# Altium project Compact Inverter H7 Logic Ver B.PrjPcb (part 1 of 2)
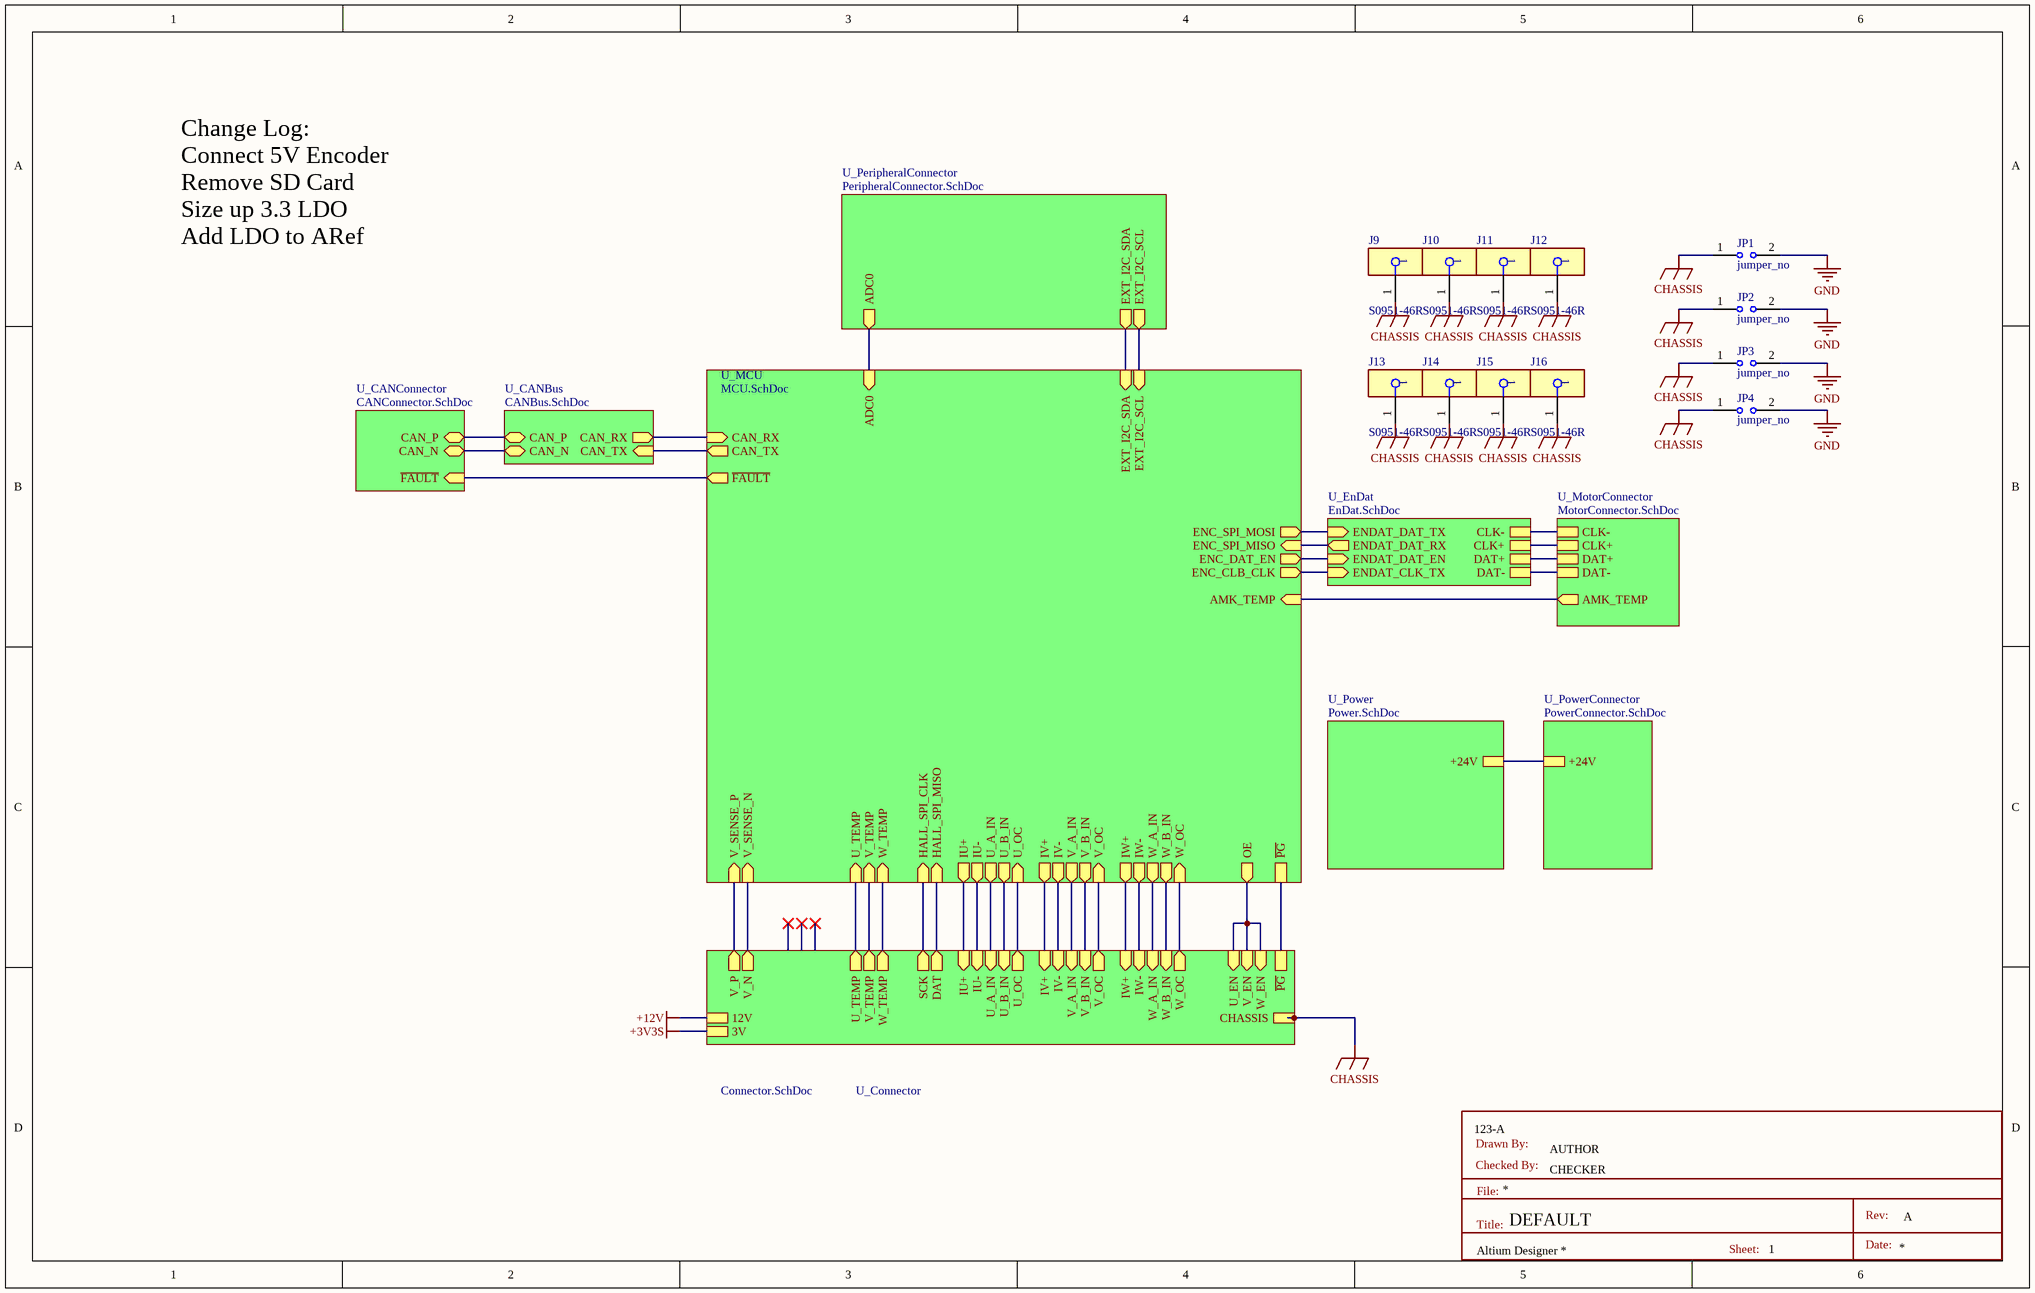
[diagram p0: Top.SchDoc]
11 sheets, 150 parts. Net scope: hierarchical (ports join the sheet entries above them; power ports are global).
Board file: PCB1.PcbDoc
Sheets:
  Top.SchDoc
    U_MCU = MCU.SchDoc
    U_Connector = Connector.SchDoc
    U_EnDat = EnDat.SchDoc
    U_CANBus = CANBus.SchDoc
    U_PeripheralConnector = PeripheralConnector.SchDoc
    U_MotorConnector = MotorConnector.SchDoc
    U_CANConnector = CANConnector.SchDoc
    U_Power = Power.SchDoc
    U_PowerConnector = PowerConnector.SchDoc
  SDMMC.SchDoc

## Sheet Top.SchDoc: DEFAULT
size B; CheckedBy: CHECKER; Author: AUTHOR; Revision: A; SheetNumber: 1; SheetTotal: 11; PartNumber: 123

### Parts
J9  S0951-46R  [FP-S0951-46R-MFG]
J10  S0951-46R  [FP-S0951-46R-MFG]
J11  S0951-46R  [FP-S0951-46R-MFG]
J12  S0951-46R  [FP-S0951-46R-MFG]
J13  S0951-46R  [FP-S0951-46R-MFG]
J14  S0951-46R  [FP-S0951-46R-MFG]
J15  S0951-46R  [FP-S0951-46R-MFG]
J16  S0951-46R  [FP-S0951-46R-MFG]
JP1  jumper_no  [jumper_no]
JP2  jumper_no  [jumper_no]
JP3  jumper_no  [jumper_no]
JP4  jumper_no  [jumper_no]

### Sub-sheets
U_CANBus = CANBus.SchDoc: CAN_TX (in), CAN_RX (out), CAN_P (bidir), CAN_N (bidir)
U_CANConnector = CANConnector.SchDoc: CAN_P (bidir), CAN_N (bidir), ~{FAULT} (in)
U_Connector = Connector.SchDoc: U_B_IN (in), U_A_IN (in), U_EN (in), U_OC (out), V_A_IN (in), V_B_IN (in), V_EN (in), V_OC (out), W_EN (in), W_OC (out), W_A_IN (in), W_B_IN (in), V_N (out), V_P (out), W_TEMP (out), V_TEMP (out), U_TEMP (out), 3V, 12V, CHASSIS, SCK (out), DAT (out), ~{PG}, IU+ (in), IU- (in), IV+ (in), IV- (in), IW+ (in), IW- (in)
U_EnDat = EnDat.SchDoc: CLK-, CLK+, DAT+, DAT-, ENDAT_DAT_RX (out), ENDAT_DAT_EN (in), ENDAT_DAT_TX (in), ENDAT_CLK_TX (in)
U_MCU = MCU.SchDoc: ENC_SPI_MOSI (out), ENC_SPI_MISO (in), HALL_SPI_MISO (in), HALL_SPI_CLK (in), EXT_I2C_SCL (in), EXT_I2C_SDA (in), CAN_RX (in), CAN_TX (out), V_A_IN (out), V_B_IN (out), V_OC (in), V_TEMP (in), U_A_IN (out), U_B_IN (out), U_OC (in), U_TEMP (in), W_A_IN (out), W_B_IN (out), W_OC (in), W_TEMP (in), AMK_TEMP (in), ENC_DAT_EN (out), ENC_CLB_CLK (out), V_SENSE_P (in), V_SENSE_N (in), OE (out), ~{FAULT} (out), ADC0 (in), ~{PG}, IU- (out), IW- (out), IU+ (out), IV+ (out), IW+ (out), IV- (out)
U_MotorConnector = MotorConnector.SchDoc: AMK_TEMP (out), CLK-, CLK+, DAT+, DAT-
U_PeripheralConnector = PeripheralConnector.SchDoc: EXT_I2C_SCL (out), EXT_I2C_SDA (out), ADC0 (out)
U_Power = Power.SchDoc: +24V
U_PowerConnector = PowerConnector.SchDoc: +24V

### Nets
CHASSIS: J9.1 J10.1 J11.1 J12.1 J13.1 J14.1 J15.1 J16.1 JP1.1 JP2.1 JP3.1 JP4.1 ; sheet U_Connector/CHASSIS
GND: JP1.2 JP2.2 JP3.2 JP4.2
+24V: sheet U_Power/+24V, sheet U_PowerConnector/+24V
ADC0: sheet U_MCU/ADC0, sheet U_PeripheralConnector/ADC0
CAN_N: sheet U_CANBus/CAN_N, sheet U_CANConnector/CAN_N
CAN_P: sheet U_CANBus/CAN_P, sheet U_CANConnector/CAN_P
DAT: sheet U_MCU/HALL_SPI_MISO, sheet U_Connector/DAT
ENC_CLB_CLK: sheet U_MCU/ENC_CLB_CLK, sheet U_EnDat/ENDAT_CLK_TX
ENC_DAT_EN: sheet U_MCU/ENC_DAT_EN, sheet U_EnDat/ENDAT_DAT_EN
ENC_SPI_MISO: sheet U_MCU/ENC_SPI_MISO, sheet U_EnDat/ENDAT_DAT_RX
ENC_SPI_MOSI: sheet U_MCU/ENC_SPI_MOSI, sheet U_EnDat/ENDAT_DAT_TX
~{FAULT}: sheet U_MCU/~{FAULT}, sheet U_CANConnector/~{FAULT}
FDCAN1_RX: sheet U_MCU/CAN_RX, sheet U_CANBus/CAN_RX
FDCAN1_TX: sheet U_MCU/CAN_TX, sheet U_CANBus/CAN_TX
HALL_SPI_CLK_S: sheet U_MCU/HALL_SPI_CLK, sheet U_Connector/SCK
I2C1_SCK: sheet U_MCU/EXT_I2C_SCL, sheet U_PeripheralConnector/EXT_I2C_SCL
I2C1_SDA: sheet U_MCU/EXT_I2C_SDA, sheet U_PeripheralConnector/EXT_I2C_SDA
IU+: sheet U_MCU/IU+, sheet U_Connector/IU+
IU-: sheet U_MCU/IU-, sheet U_Connector/IU-
IV+: sheet U_MCU/IV+, sheet U_Connector/IV+
IV-: sheet U_MCU/IV-, sheet U_Connector/IV-
IW+: sheet U_MCU/IW+, sheet U_Connector/IW+
IW-: sheet U_MCU/IW-, sheet U_Connector/IW-
OE: sheet U_MCU/OE, sheet U_Connector/U_EN, sheet U_Connector/V_EN, sheet U_Connector/W_EN
~{PG}_S: sheet U_MCU/~{PG}, sheet U_Connector/~{PG}
TEMP1: sheet U_MCU/U_TEMP, sheet U_Connector/U_TEMP
TEMP2: sheet U_MCU/V_TEMP, sheet U_Connector/V_TEMP
TEMP3: sheet U_MCU/W_TEMP, sheet U_Connector/W_TEMP
TEMP4: sheet U_MCU/AMK_TEMP, sheet U_MotorConnector/AMK_TEMP
U_A_IN: sheet U_MCU/U_A_IN, sheet U_Connector/U_A_IN
U_B_IN: sheet U_MCU/U_B_IN, sheet U_Connector/U_B_IN
U_OC: sheet U_MCU/U_OC, sheet U_Connector/U_OC
V_A_IN: sheet U_MCU/V_A_IN, sheet U_Connector/V_A_IN
V_B_IN: sheet U_MCU/V_B_IN, sheet U_Connector/V_B_IN
V_OC: sheet U_MCU/V_OC, sheet U_Connector/V_OC
V_SENSE_N: sheet U_MCU/V_SENSE_N, sheet U_Connector/V_N
V_SENSE_P: sheet U_MCU/V_SENSE_P, sheet U_Connector/V_P
W_A_IN: sheet U_MCU/W_A_IN, sheet U_Connector/W_A_IN
W_B_IN: sheet U_MCU/W_B_IN, sheet U_Connector/W_B_IN
W_OC: sheet U_MCU/W_OC, sheet U_Connector/W_OC
NetC1_2: sheet U_EnDat/DAT+, sheet U_MotorConnector/DAT+
NetC3_1: sheet U_EnDat/DAT-, sheet U_MotorConnector/DAT-
NetC4_2: sheet U_EnDat/CLK+, sheet U_MotorConnector/CLK+
NetC6_1: sheet U_EnDat/CLK-, sheet U_MotorConnector/CLK-

### Notes on the sheet
- Change Log:
  Connect 5V Encoder
  Remove SD Card
  Size up 3.3 LDO
  Add LDO to ARef
- Drawn By:
- Checked By:
- File:
- Title:
- Sheet:
- Rev:
- Date:

### Library data of the parts
J9-J16 = CMP-15817-000012-1: RFI SHIELD CLIP MINI TIN SMD; Width: 0.04inch; Min Operating Temperature: -40°C; Max Operating Temperature: 185°C; Thickness: 0.051inch; REACH SVHC: No SVHC; Length: 0.155inch

## Sheet MCU.SchDoc
size B; SheetNumber: 5; SheetTotal: 11
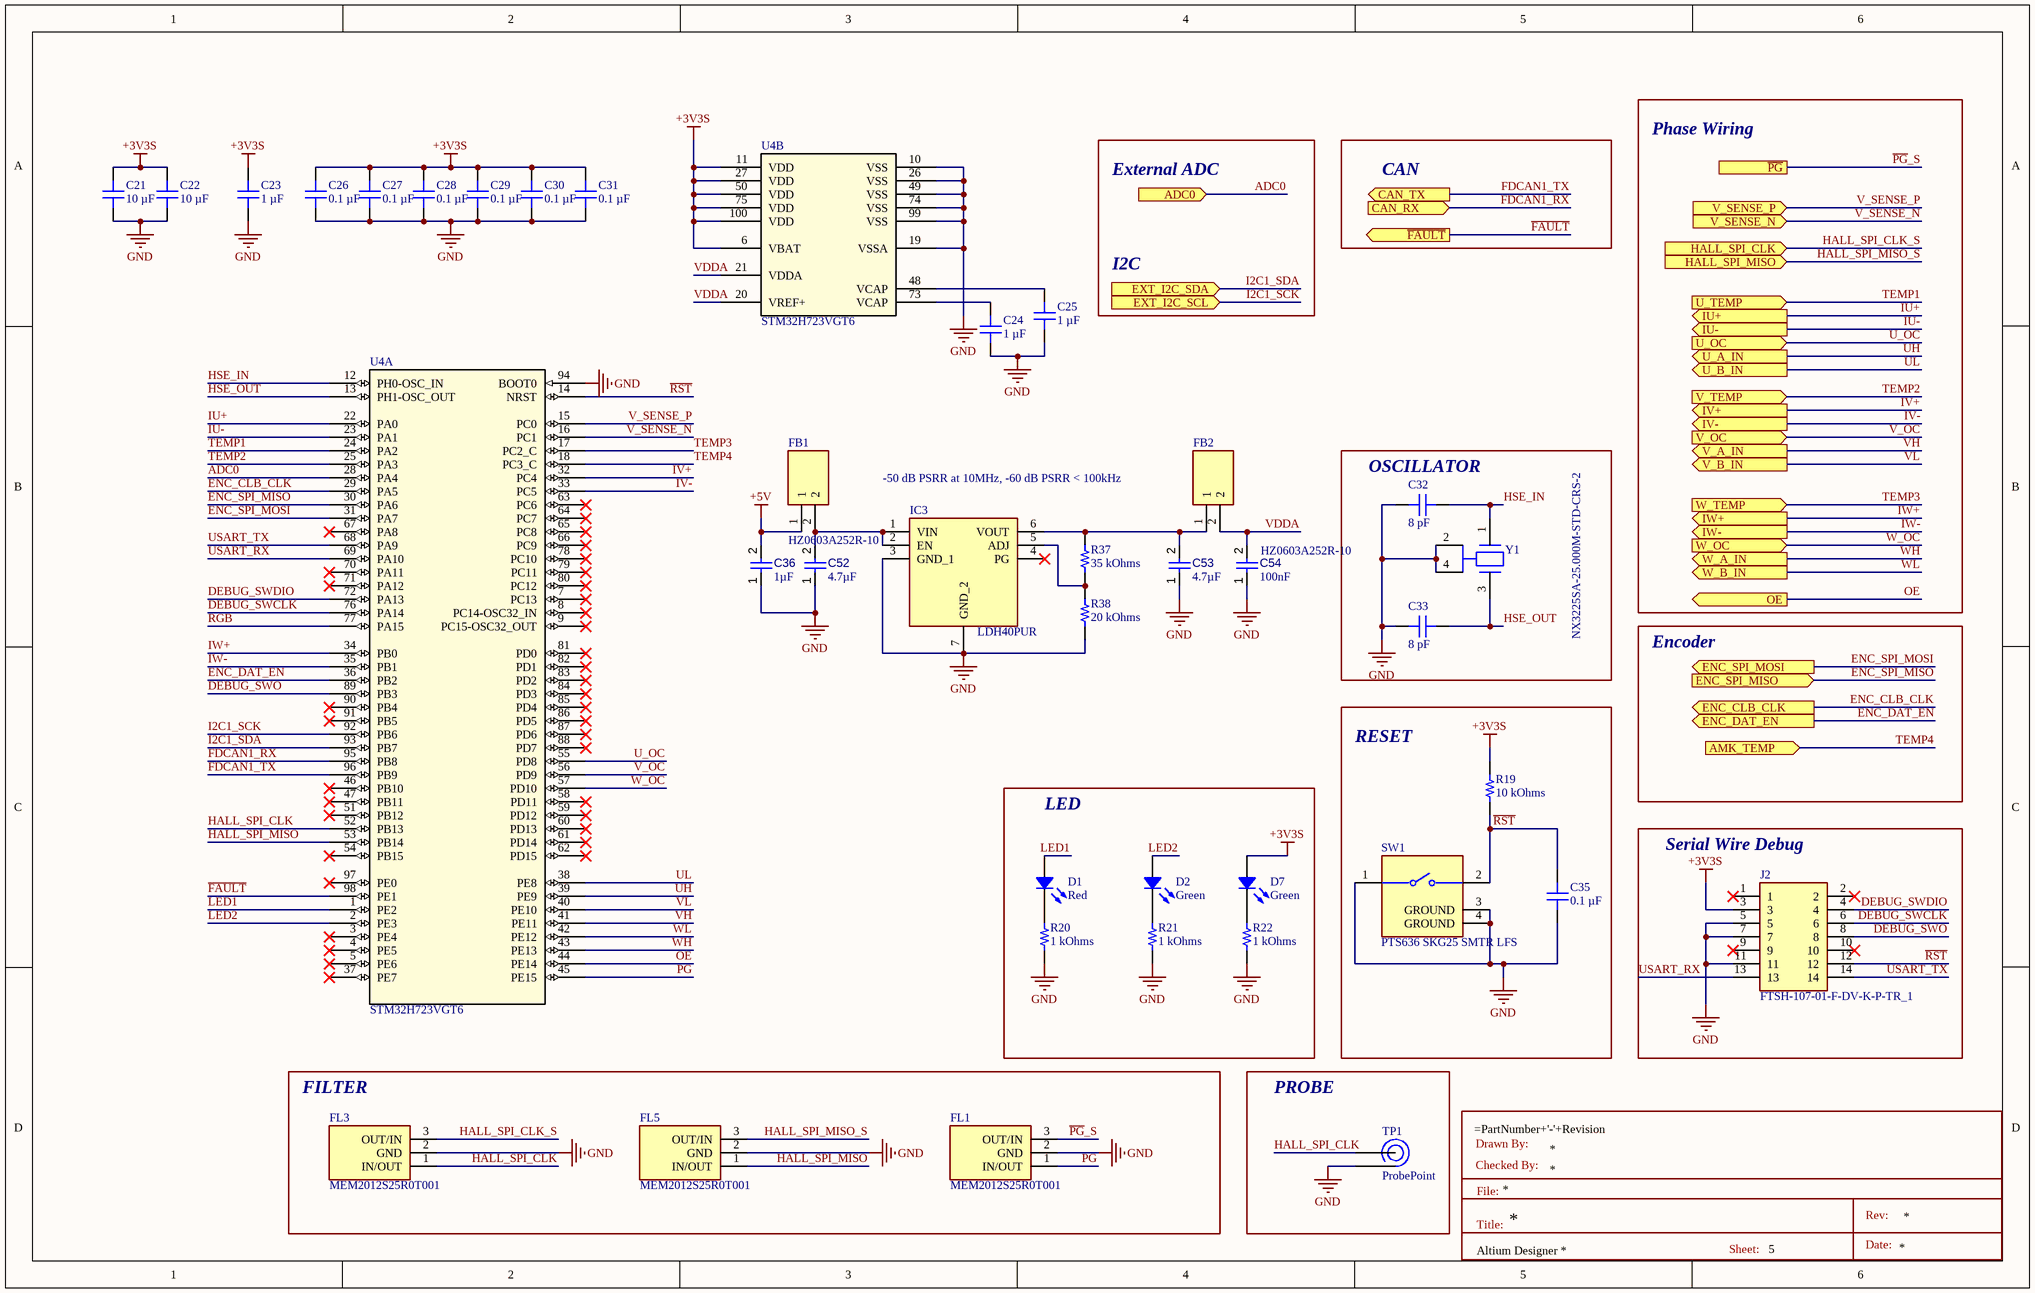
[diagram p1: MCU.SchDoc]

### Parts
C21  10 µF  [CAP 0402_1005]
C22  10 µF  [CAP 0402_1005]
C23  1 µF  [MURATA GRM155 0402_1005]
C24  1 µF  [MURATA GRM155 0402_1005]
C25  1 µF  [MURATA GRM155 0402_1005]
C26  0.1 µF  [CAP 0402_1005]
C27  0.1 µF  [CAP 0402_1005]
C28  0.1 µF  [CAP 0402_1005]
C29  0.1 µF  [CAP 0402_1005]
C30  0.1 µF  [CAP 0402_1005]
C31  0.1 µF  [CAP 0402_1005]
C32  8 pF  [CAP 0402_1005]
C33  8 pF  [CAP 0402_1005]
C35  0.1 µF  [CAP 0402_1005]
C36  value 1µF  [CAPC0402(1005)60_L]  (hidden comment: Capacitor 1µF +/-20% 10V 0402)
C52  value 4.7µF  [CAPC0402(1005)60_L]  (hidden comment: Capacitor 1µF +/-20% 10V 0402)
C53  value 4.7µF  [CAPC0402(1005)60_L]  (hidden comment: Capacitor 1µF +/-20% 10V 0402)
C54  value 100nF  [CAPC0402(1005)60_L]  (hidden comment: Capacitor 100nF +/-20% 25V 0402)
D1  Red  [LED 0603_1608 RED]
D2  Green  [LED 0603_1608 GREEN]
D7  Green  [LED 0603_1608 GREEN]
FB1  HZ0603A252R-10  [BEADC1608X95N]
FB2  HZ0603A252R-10  [BEADC1608X95N]
FL1  MEM2012S25R0T001  [MEM2012S25R0T001]
FL3  MEM2012S25R0T001  [MEM2012S25R0T001]
FL5  MEM2012S25R0T001  [MEM2012S25R0T001]
IC3  LDH40PUR  [SON65P200X200X80-7N]
J2  FTSH-107-01-F-DV-K-P-TR_1  [FTSH-107-XX-YYY-DV-K-P-TR]
R19  10 kOhms  [RES 0402_1005]
R20  1 kOhms  [RES 0402_1005]
R21  1 kOhms  [RES 0402_1005]
R22  1 kOhms  [RES 0402_1005]
R37  35 kOhms  [RES 0402_1005]
R38  20 kOhms  [RES 0402_1005]
SW1  PTS636 SKG25 SMTR LFS  [FP-PTS636_SKG25_SMTR_LFS-MFG]
TP1  ProbePoint  [ProbePoint]
U4  STM32H723VGT6  [LQFP100_STM]  (parts A,B of 2)
Y1  NX3225SA-25.000M-STD-CRS-2  [FP-NX3225SA-MFG]

### Blocks framed on the sheet
OSCILLATOR: C32 C33 Y1
RESET: C35 R19 SW1
LED: D1 D2 D7 R20-R22
Serial Wire Debug: J2
FILTER: FL1 FL3 FL5
PROBE: TP1

### Ports
ADC0 (in), AMK_TEMP (in), CAN_RX (in), CAN_TX (out), ENC_CLB_CLK (out), ENC_DAT_EN (out), ENC_SPI_MISO (in), ENC_SPI_MOSI (out), EXT_I2C_SCL (in), EXT_I2C_SDA (in), HALL_SPI_CLK (in), HALL_SPI_MISO (in), IU+ (out), IU- (out), IV+ (out), IV- (out), IW+ (out), IW- (out), OE (out), U_A_IN (out), U_B_IN (out), U_OC (in), U_TEMP (in), V_A_IN (out), V_B_IN (out), V_OC (in), V_SENSE_N (in), V_SENSE_P (in), V_TEMP (in), W_A_IN (out), W_B_IN (out), W_OC (in), W_TEMP (in), ~{FAULT} (out), ~{PG}

### Nets
+3V3S: C21.2 C22.2 C23.2 C26.2 C27.2 C28.2 C29.2 C30.2 C31.2 D7.1 J2.3 R19.2 U4.6(VBAT) U4.11(VDD) U4.27(VDD) U4.50(VDD) U4.75(VDD) U4.100(VDD)  [project net 3V]
+5V: C36.2 FB1.1
GND: C21.1 C22.1 C23.1 C24.1 C25.1 C26.1 C27.1 C28.1 C29.1 C30.1 C31.1 C32.2 C33.2 C35.1 C36.1 C52.1 C53.1 C54.1 FL1.2(GND) FL3.2(GND) FL5.2(GND) IC3.3(GND_1) IC3.7(GND_2) J2.5 J2.7 J2.11 R20.1 R21.1 R22.1 R38.2 SW1.1 SW1.3(GROUND) SW1.4(GROUND) TP1.2 U4.10(VSS) U4.19(VSSA) U4.26(VSS) U4.49(VSS) U4.74(VSS) U4.94(BOOT0) U4.99(VSS) Y1.2(GND) Y1.4(GND)
ADC0: U4.28(PA4) ; port ADC0
DEBUG_SWCLK: J2.6 U4.76(PA14)
DEBUG_SWDIO: J2.4 U4.72(PA13)
DEBUG_SWO: J2.8 U4.89(PB3)
ENC_CLB_CLK: U4.29(PA5) ; port ENC_CLB_CLK
ENC_DAT_EN: U4.36(PB2) ; port ENC_DAT_EN
ENC_SPI_MISO: U4.30(PA6) ; port ENC_SPI_MISO
ENC_SPI_MOSI: U4.31(PA7) ; port ENC_SPI_MOSI
~{FAULT}: U4.98(PE1) ; port ~{FAULT}
FDCAN1_RX: U4.95(PB8) ; port CAN_RX
FDCAN1_TX: U4.96(PB9) ; port CAN_TX
HALL_SPI_CLK: FL3.1(IN/OUT) TP1.1 U4.52(PB13)
HALL_SPI_CLK_S: FL3.3(OUT/IN) ; port HALL_SPI_CLK
HALL_SPI_MISO: FL5.1(IN/OUT) U4.53(PB14)
HALL_SPI_MISO_S: FL5.3(OUT/IN) ; port HALL_SPI_MISO  [project net DAT]
HSE_IN: C32.1 U4.12(PH0-OSC_IN) Y1.1
HSE_OUT: C33.1 U4.13(PH1-OSC_OUT) Y1.3
I2C1_SCK: U4.92(PB6) ; port EXT_I2C_SCL
I2C1_SDA: U4.93(PB7) ; port EXT_I2C_SDA
IU+: U4.22(PA0) ; port IU+
IU-: U4.23(PA1) ; port IU-
IV+: U4.32(PC4) ; port IV+
IV-: U4.33(PC5) ; port IV-
IW+: U4.34(PB0) ; port IW+
IW-: U4.35(PB1) ; port IW-
LED1: D1.1 U4.1(PE2)
LED2: D2.1 U4.2(PE3)
OE: U4.44(PE14) ; port OE
~{PG}: FL1.1(IN/OUT) U4.45(PE15)
~{PG}_S: FL1.3(OUT/IN) ; port ~{PG}
~{RST}: C35.2 J2.12 R19.1 SW1.2 U4.14(NRST)
RGB: U4.77(PA15)
TEMP1: U4.24(PA2) ; port U_TEMP
TEMP2: U4.25(PA3) ; port V_TEMP
TEMP3: U4.17(PC2_C) ; port W_TEMP
TEMP4: U4.18(PC3_C) ; port AMK_TEMP
U_OC: U4.55(PD8) ; port U_OC
UH: U4.39(PE9) ; port U_A_IN  [project net U_A_IN]
UL: U4.38(PE8) ; port U_B_IN  [project net U_B_IN]
USART_RX: J2.13 U4.69(PA10)
USART_TX: J2.14 U4.68(PA9)
V_OC: U4.56(PD9) ; port V_OC
V_SENSE_N: U4.16(PC1) ; port V_SENSE_N
V_SENSE_P: U4.15(PC0) ; port V_SENSE_P
VDDA: C54.2 FB2.2 U4.20(VREF+) U4.21(VDDA)
VH: U4.41(PE11) ; port V_A_IN  [project net V_A_IN]
VL: U4.40(PE10) ; port V_B_IN  [project net V_B_IN]
W_OC: U4.57(PD10) ; port W_OC
WH: U4.43(PE13) ; port W_A_IN  [project net W_A_IN]
WL: U4.42(PE12) ; port W_B_IN  [project net W_B_IN]
NetC24_2: C24.2 U4.73(VCAP)
NetC25_2: C25.2 U4.48(VCAP)
NetC52_2: C52.2 FB1.2 IC3.1(VIN) IC3.2(EN)
NetC53_2: C53.2 FB2.1 IC3.6(VOUT) R37.1
NetD1_2: D1.2 R20.2
NetD2_2: D2.2 R21.2
NetD7_2: D7.2 R22.2
NetIC3_5: IC3.5(ADJ) R37.2 R38.1

Not connected (* = marked no-connect by the designer): IC3 4(PG)*; J2 1* 2* 9* 10*; U4 3(PE4)* 4(PE5)* 5(PE6)* 7(PC13)* 8(PC14-OSC32_IN)* 9(PC15-OSC32_OUT)* 37(PE7)* 46(PB10)* 47(PB11)* 51(PB12)* 54(PB15)* 58(PD11)* 59(PD12)* 60(PD13)* 61(PD14)* 62(PD15)* 63(PC6)* 64(PC7)* 65(PC8)* 66(PC9)* 67(PA8)* 70(PA11)* 71(PA12)* 78(PC10)* 79(PC11)* 80(PC12)* 81(PD0)* 82(PD1)* 83(PD2)* 84(PD3)* 85(PD4)* 86(PD5)* 87(PD6)* 88(PD7)* 90(PB4)* 91(PB5)* 97(PE0)*

### Notes on the sheet
- Phase Wiring
- External ADC
- CAN
- I2C
- -50 dB PSRR at 10MHz, -60 dB PSRR < 100kHz
- Encoder
- Drawn By:
- Checked By:
- File:
- Title:
- Sheet:
- Rev:
- Date:

### Library data of the parts
C21 C22 = CL05A106MP8NUB8: CAP CER 10UF 10V X5R 0402; manufacturer: Samsung Electro-Mechanics; Tolerance: ±20%; Part Number: CL05A106MP8NUB8; Capacitance: 10 µF; Applications: Acoustic Noise Reduction; componentlink1description: Datasheet; componentlink1url: http://www.samsungsem.com/kr/support/product-search/mlcc/CL05A106MP8NUB8.jsp; componentlink2description: DigiKey Link; componentlink2url: https://www.digikey.com/en/products/detail/samsung-electro-mechanics/CL05A106MP8NUB8/5961314; Device Package: 0402 (1005 Metric); lastupdated: 2/9/2024 8:04:38 PM; Lifecycle Status: Active; Minimum Order: 1; Mounting Type: Surface Mount, MLCC; Operating Temperature: -55°C ~ 85°C; Package / Case: 0402 (1005 Metric); packaging: TapeAndReel; partid: 1758; Part Status: Active; price: 0.06; series: CL; Size / Dimension: 0.039" L x 0.020" W (1.00mm x 0.50mm); Supplier 1: DigiKey; Supplier Part Number 1: 1276-6830-1-ND; Temperature Coefficient: X5R; Thickness (Max): 0.035" (0.90mm); value: 10 µF; Voltage - Rated: 10V
C23-C25 = GRM155C71A105KE11D: CAP CER 1UF 10V X7S 0402; manufacturer: Murata Electronics; Tolerance: ±10%; Part Number: GRM155C71A105KE11D; Capacitance: 1 µF; Applications: General Purpose; componentlink1description: Datasheet; componentlink1url: https://search.murata.co.jp/Ceramy/image/img/A01X/G101/ENG/GRM155C71A105KE11-01.pdf; componentlink2description: DigiKey Link; componentlink2url: https://www.digikey.com/en/products/detail/murata-electronics/GRM155C71A105KE11D/6606086; Device Package: 0402 (1005 Metric); lastupdated: 7/23/2025 10:42:36 AM; Lifecycle Status: Active; Minimum Order: 1; Mounting Type: Surface Mount, MLCC; Operating Temperature: -55°C ~ 125°C; Package / Case: 0402 (1005 Metric); packaging: TapeAndReel; partid: 1749; Part Status: Active; price: 0.01; series: GRM; Size / Dimension: 0.039" L x 0.020" W (1.00mm x 0.50mm); Supplier 1: DigiKey; Supplier Part Number 1: 490-14457-1-ND; Temperature Coefficient: X7S; Thickness (Max): 0.024" (0.60mm); value: 1 µF; Voltage - Rated: 10V
C26-C31 C35 = C0402C104K4RECAUTO: CAP CER 0402 0.1UF 16V X7R 10%; manufacturer: KEMET; Part Number: C0402C104K4RECAUTO; Capacitance: 0.1 µF; Applications: Automotive, ESD Protection; componentlink1description: Datasheet; componentlink1url: https://api.kemet.com/component-edge/download/datasheet/C0402C104K4RECAUTO.pdf; componentlink2description: DigiKey Link; componentlink2url: https://www.digikey.com/en/products/detail/kemet/C0402C104K4RECAUTO/8563695; Device Package: 0402 (1005 Metric); lastupdated: 2/9/2024 8:04:38 PM; Lifecycle Status: Active; Minimum Order: 1; Mounting Type: Surface Mount, MLCC; Operating Temperature: -55°C ~ 125°C; Package / Case: 0402 (1005 Metric); packaging: TapeAndReel; partid: 1731; Part Status: Active; price: 0.01; Ratings: AEC-Q200; series: ESD SMD Auto X7R; Size / Dimension: 0.039" L x 0.020" W (1.00mm x 0.50mm); Supplier 1: DigiKey; Supplier Part Number 1: 399-17167-1-ND; Temperature Coefficient: X7R; Thickness (Max): 0.022" (0.55mm); Tolerance: ±10%; value: 0.1 µF; Voltage - Rated: 16V
C32 C33 = HMK105CG080DV-F: CAP CER 8PF 100V C0G/NP0 0402; manufacturer: Taiyo Yuden; Temperature Coefficient: C0G, NP0; Tolerance: ±0.5pF; Part Number: HMK105CG080DV-F; Capacitance: 8 pF; Applications: General Purpose; componentlink1description: Datasheet; componentlink1url: http://www.yuden.co.jp/productdata/catalog/mlcc06_e.pdf; componentlink2description: DigiKey Link; componentlink2url: https://www.digikey.com/en/products/detail/taiyo-yuden/HMK105CG080DV-F/6563590; Device Package: 0402 (1005 Metric); lastupdated: 2/9/2024 8:04:38 PM; Lifecycle Status: Active; Minimum Order: 1; Mounting Type: Surface Mount, MLCC; Operating Temperature: -55°C ~ 125°C; Package / Case: 0402 (1005 Metric); packaging: TapeAndReel; partid: 1851; Part Status: Active; price: 0.03; series: M; Size / Dimension: 0.039" L x 0.020" W (1.00mm x 0.50mm); Supplier 1: DigiKey; Supplier Part Number 1: 587-4997-1-ND; Thickness (Max): 0.022" (0.55mm); value: 8 pF; Voltage - Rated: 100V
C36 C52 C53 = CMP-001-00063-3: Chip Capacitor, 1µF +/-20%, 10V, 0402, Thickness 0.6 mm; Tolerance: 10%; Mounting Technology: SMT; Max Operating Temperature: 85°C; Voltage Rating: 10V; Pins: 2; Case/Package: 0402; Min Operating Temperature: -55°C
C54 = CMP-001-00065-4: Chip Capacitor, 100nF +/-20%, 25V, 0402, Thickness 0.6 mm; Tolerance: 10%; Max Operating Temperature: 85°C; Min Operating Temperature: -55°C; Pins: 2; Voltage Rating: 25V; Mounting Technology: SMT; Case/Package: 0402
D1 = 5973005507F: LED RED 0603 SMD; Manufacturer: Dialight; Configuration: Standard; Current - Test: 20mA; Lens Color: 0.68mm; Lens Size: 1.20mm x 0.80mm; Lens Style: Rectangle with Flat Top; Millicandela Rating: 90mcd; Voltage - Forward (Vf) (Typ): 2V; Wavelength - Dominant: 630nm; Part Number: 5973005507F; Color: Red; ComponentLink1Description: Datasheet; ComponentLink1URL: http://www.dialightsignalsandcomponents.com/Assets/Drawings/2D_Drawings_DrawingDetailedSpec/NewDrawings/18369A.pdf; ComponentLink2Description: DigiKey Link; ComponentLink2URL: https://www.digikey.com/en/products/detail/dialight/5973005507F/9385429; Device Package: 0603 (1608 Metric); Height (Max): 0.68mm; LastUpdated: 6/3/2024 7:59:48 PM; Lifecycle Status: Active; Minimum Order: 1; Mounting Type: Surface Mount; Package / Case: 0603 (1608 Metric); Packaging: TapeAndReel; PartId: 378; Part Status: Active; Price: 0.08; Series: 597; Size / Dimension: 1.60mm L x 0.80mm W; Supplier 1: DigiKey; Supplier Part Number 1: 350-4374-1-ND; Supplier Device Package: 0603; Value: Red
D2 D7 = 5973316507F: LED GREEN 0603 SMD; Manufacturer: Dialight; Configuration: Standard; Current - Test: 20mA; Lens Color: 1.24mm; Lens Style: Round with Domed Top; Millicandela Rating: 34mcd; Voltage - Forward (Vf) (Typ): 2V; Wavelength - Dominant: 560nm; Part Number: 5973316507F; Color: Green; ComponentLink1Description: Datasheet; ComponentLink1URL: http://www.dialightsignalsandcomponents.com/Assets/Drawings/2D_Drawings_DrawingDetailedSpec/NewDrawings/C18371C.pdf; ComponentLink2Description: DigiKey Link; ComponentLink2URL: https://www.digikey.com/en/products/detail/dialight/5973316507F/9385428; Device Package: 0603 (1608 Metric); Height (Max): 1.24mm; LastUpdated: 6/3/2024 7:58:53 PM; Lifecycle Status: Active; Minimum Order: 1; Mounting Type: Surface Mount; Package / Case: 0603 (1608 Metric); Packaging: TapeAndReel; PartId: 587; Part Status: Active; Price: 0.13; Series: 597; Size / Dimension: 1.60mm L x 0.80mm W; Supplier 1: DigiKey; Supplier Part Number 1: 350-4373-1-ND; Supplier Device Package: 0603; Value: Green
FB1 FB2 = HZ0603A252R-10: Ferrite Bead; Manufacturer_Name: Laird Performance Materials; Datasheet Link: https://componentsearchengine.com/Datasheets/1/HZ0603A252R-10.pdf; Height: 0.95mm; Manufacturer_Part_Number: HZ0603A252R-10; Mouser Part Number: 875-HZ0603A252R-10; Mouser Price/Stock: https://www.mouser.co.uk/ProductDetail/Laird-Performance-Materials/HZ0603A252R-10?qs=D%252B9bHg9FvUOIwh1ifAKqqw%3D%3D
FL1 FL3 FL5 = MEM2012S25R0T001: Filter; Manufacturer_Name: TDK; Datasheet Link: https://product.tdk.com/system/files/dam/doc/product/emc/emc/3tf/catalog/3tf_commercial_signal_mem2012s_en.pdf; Height: 1mm; Manufacturer_Part_Number: MEM2012S25R0T001; Mouser Part Number: 810-MEM2012S25R0T001; Mouser Price/Stock: https://www.mouser.co.uk/ProductDetail/TDK/MEM2012S25R0T001?qs=uxmvvYJjMIvgfrdEOPTgFw%3D%3D; Arrow Part Number: MEM2012S25R0T001; Arrow Price/Stock: https://www.arrow.com/en/products/mem2012s25r0t001/tdk?region=nac
IC3 = LDH40PUR: Integrated Circuit; Manufacturer_Name: STMicroelectronics; Datasheet Link: https://www.st.com/resource/en/datasheet/ldh40.pdf; Height: 0.8mm; Manufacturer_Part_Number: LDH40PUR
J2 = FTSH-107-01-F-DV-K-P-TR_1: Connector; Manufacturer_Name: SAMTEC; Datasheet Link: http://suddendocs.samtec.com/prints/ftsh-1xx-xx-xxx-dv-xxx-xxx-mkt.pdf; Manufacturer_Part_Number: FTSH-107-01-F-DV-K-P-TR; Mouser Part Number: 200-FTSH10701FDVKPTR; Mouser Price/Stock: https://www.mouser.co.uk/ProductDetail/Samtec/FTSH-107-01-F-DV-K-P-TR?qs=%252BZP6%2F%252BtExtAI0atx6lcXTg%3D%3D; Arrow Part Number: FTSH-107-01-F-DV-K-P-TR; Arrow Price/Stock: https://www.arrow.com/en/products/ftsh-107-01-f-dv-k-p-tr/samtec?region=nac
R19 = WR04X1002FTL: RES 10K OHM 1% 1/16W 0402; Manufacturer: Walsin Technology Corporation; Power (Watts): 0.063W, 1/16W; Temperature Coefficient: ±100ppm/°C; Part Number: WR04X1002FTL; Value: 10 kOhms; ComponentLink1Description: Datasheet; ComponentLink1URL: https://www.passivecomponent.com/wp-content/uploads/chipR/ASC_WR.pdf; ComponentLink2Description: DigiKey Link; ComponentLink2URL: https://www.digikey.com/en/products/detail/walsin-technology-corporation/WR04X1002FTL/13241339; Composition: Thick Film; Device Package: 0402 (1005 Metric); Height - Seated (Max): 0.016" (0.40mm); LastUpdated: 2/9/2024 8:28:51 PM; Lifecycle Status: Active; Minimum Order: 1; Number of Terminations: 2; Operating Temperature: -55°C ~ 155°C; Package / Case: 0402 (1005 Metric); Packaging: CutTape; PartId: 67325; Part Status: Active; Price: 0.01; Resistance: 10 kOhms; Series: WR; Size / Dimension: 0.039" L x 0.020" W (1.00mm x 0.50mm); Supplier 1: DigiKey; Supplier Part Number 1: 1292-WR04X1002FTLCT-ND; Supplier Device Package: 0402; Tolerance: ±1%
R20-R22 = WR04X102 JTL: RES 1K OHM 5% 1/16W 0402; Manufacturer: Walsin Technology Corporation; Power (Watts): 0.063W, 1/16W; Temperature Coefficient: ±100ppm/°C; Part Number: WR04X102 JTL; Value: 1 kOhms; ComponentLink1Description: Datasheet; ComponentLink1URL: https://www.passivecomponent.com/wp-content/uploads/chipR/ASC_WR.pdf; ComponentLink2Description: DigiKey Link; ComponentLink2URL: https://www.digikey.com/en/products/detail/walsin-technology-corporation/WR04X102-JTL/13238927; Composition: Thick Film; Device Package: 0402 (1005 Metric); Height - Seated (Max): 0.016" (0.40mm); LastUpdated: 2/9/2024 8:28:50 PM; Lifecycle Status: Active; Minimum Order: 1; Number of Terminations: 2; Operating Temperature: -55°C ~ 155°C; Package / Case: 0402 (1005 Metric); Packaging: CutTape; PartId: 68140; Part Status: Active; Price: 0.01; Resistance: 1 kOhms; Series: WR; Size / Dimension: 0.039" L x 0.020" W (1.00mm x 0.50mm); Supplier 1: DigiKey; Supplier Part Number 1: 1292-WR04X102JTLCT-ND; Supplier Device Package: 0402; Tolerance: ±5%
R37 R38 = WR04X102 JTL: RES 1K OHM 5% 1/16W 0402; Manufacturer: Walsin Technology Corporation; Power (Watts): 0.063W, 1/16W; Resistance: 1 kOhms; Temperature Coefficient: ±100ppm/°C; Part Number: WR04X102 JTL; ComponentLink1Description: Datasheet; ComponentLink1URL: https://www.passivecomponent.com/wp-content/uploads/chipR/ASC_WR.pdf; ComponentLink2Description: DigiKey Link; ComponentLink2URL: https://www.digikey.com/en/products/detail/walsin-technology-corporation/WR04X102-JTL/13238927; Composition: Thick Film; Device Package: 0402 (1005 Metric); Height - Seated (Max): 0.016" (0.40mm); LastUpdated: 2/9/2024 8:28:50 PM; Lifecycle Status: Active; Minimum Order: 1; Number of Terminations: 2; Operating Temperature: -55°C ~ 155°C; Package / Case: 0402 (1005 Metric); Packaging: CutTape; PartId: 68140; Part Status: Active; Price: 0.01; Series: WR; Size / Dimension: 0.039" L x 0.020" W (1.00mm x 0.50mm); Supplier 1: DigiKey; Supplier Part Number 1: 1292-WR04X102JTLCT-ND; Supplier Device Package: 0402; Tolerance: ±5%
  R37: Value: 35 kOhms
  R38: Value: 20 kOhms
SW1 = CMP-10040-000025-1: TACT 6.0 X 3.5, 2.5 MM H, 250GF,
U4 = STM32H723VGT6: No Description Available; Mfr_Name: STMicroelectronics; RefDes: RefDes; Type: Type
Y1 = CMP-200220-000002-1: CRYSTAL 25.0000MHZ 8PF SMD; Manufacturer: NDK; Frequency: 25MHz; Automotive Grade: Grade 1; Esr: 100Ω; Tolerance: 15ppm; Digikey Description: CRYSTAL 25.0000MHZ 8PF SMD; Temperature Range Low: -40°C; Octopart: https://octopart.com/nx3225sa-25.000m-std-crs-2-ndk-51374293; Series: NX3225SA; Manufacturer Part Number: NX3225SA-25.000M-STD-CRS-2; ComponentLink2URL: https://www.ndk.com/images/products/catalog/c_NX3225SA-STD-CRS-2_e.pdf; Lead Free: Yes; Device Class L2: Crystals / Oscillators; ComponentLink2Description: Datasheet; Device Class L3: Crystals; Category: Crys; Device Class L1: Passive Components; Automotive: Yes; RoHS: TRUE; Load Capacitance: 8pF; Height: 0.6mm; Temperature Range High: +125°C; Package: NX3225SA; Temperature: -40°C to +125°C

## Sheet Connector.SchDoc
size 431 x 279 mm; SheetNumber: 4; SheetTotal: 11
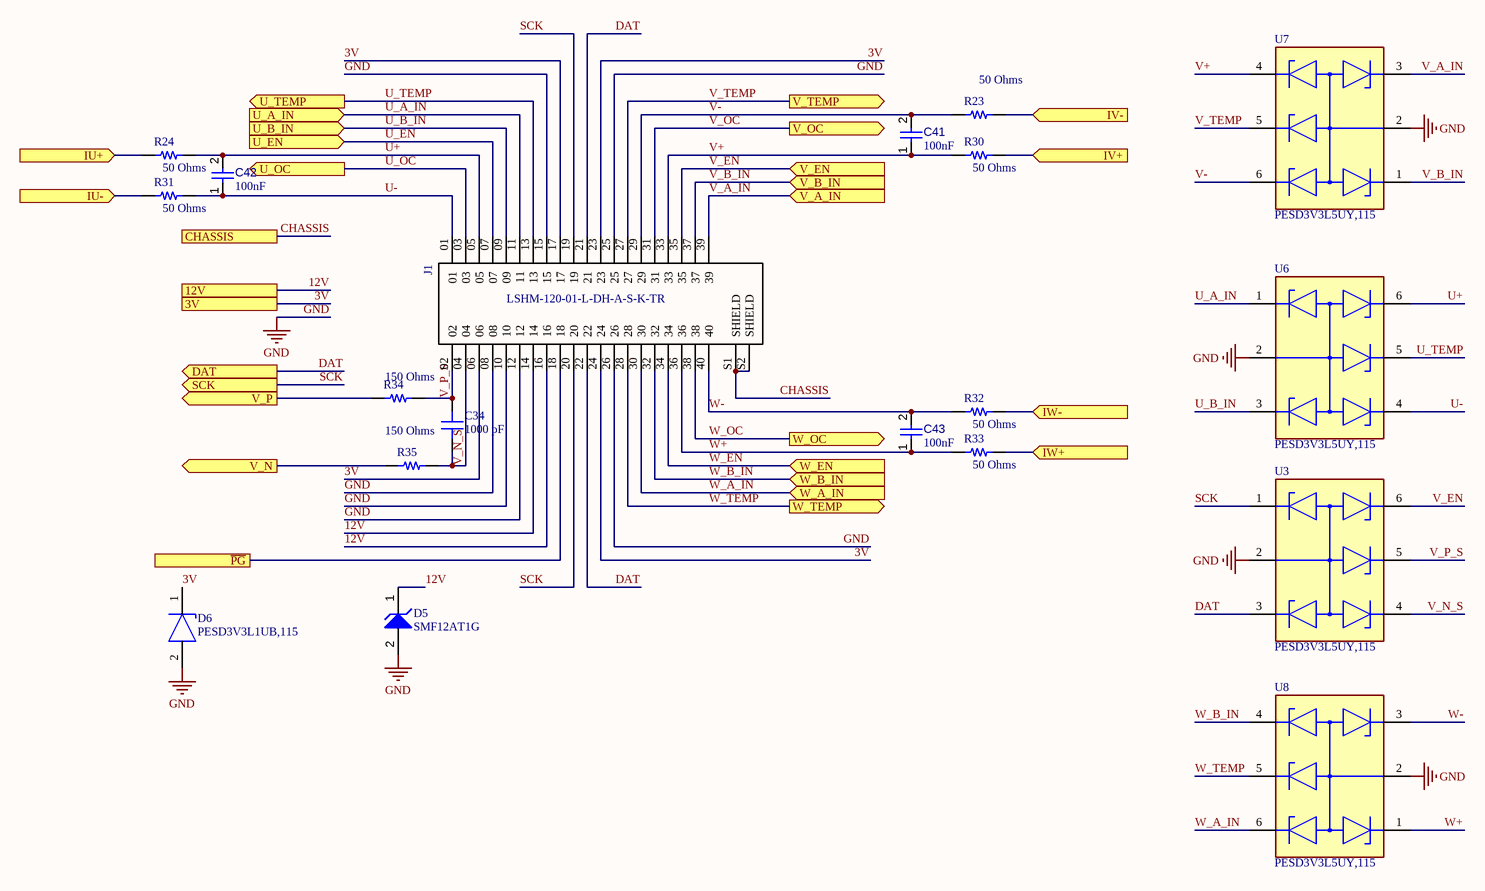
[diagram p2: Connector.SchDoc]

### Parts
C34  1000 pF  [CAP 0402_1005]
C41  value 100nF  [CAPC0402(1005)60_L]  (hidden comment: Capacitor 100nF +/-20% 10V 0402)
C42  value 100nF  [CAPC0402(1005)60_L]  (hidden comment: Capacitor 100nF +/-20% 10V 0402)
C43  value 100nF  [CAPC0402(1005)60_L]  (hidden comment: Capacitor 100nF +/-20% 10V 0402)
D5  SMF12AT1G  [ONSC-SOD-123FL-2-498_V]
D6  PESD3V3L1UB,115  [FP-SOD523-MFG]
J1  LSHM-120-01-L-DH-A-S-K-TR  [*SAMTEC_LSHM-120-01-L-DH-A-S-K-TR_LSHM-120-01-L-DH-A-S-K-TR(Primary)]
R23  50 Ohms  [RES 0402_1005]
R24  50 Ohms  [RES 0402_1005]
R30  50 Ohms  [RES 0402_1005]
R31  50 Ohms  [RES 0402_1005]
R32  50 Ohms  [RES 0402_1005]
R33  50 Ohms  [RES 0402_1005]
R34  150 Ohms  [RES 0402_1005]
R35  150 Ohms  [RES 0402_1005]
U3  PESD3V3L5UY,115  [FP-SOT363-IPC_A]
U6  PESD3V3L5UY,115  [FP-SOT363-IPC_A]
U7  PESD3V3L5UY,115  [FP-SOT363-IPC_A]
U8  PESD3V3L5UY,115  [FP-SOT363-IPC_A]

### Ports
3V, 12V, CHASSIS, DAT (out), IU+ (in), IU- (in), IV+ (in), IV- (in), IW+ (in), IW- (in), SCK (out), U_A_IN (in), U_B_IN (in), U_EN (in), U_OC (out), U_TEMP (out), V_A_IN (in), V_B_IN (in), V_EN (in), V_N (out), V_OC (out), V_P (out), V_TEMP (out), W_A_IN (in), W_B_IN (in), W_EN (in), W_OC (out), W_TEMP (out), ~{PG}

### Nets
3V: D6.1(C) J1.06 J1.17 J1.23 J1.24 ; port 3V
12V: D5.1(K) J1.14 J1.16 ; port 12V
CHASSIS: J1.S1(SHIELD) J1.S2(SHIELD) ; port CHASSIS
GND: D5.2(A) D6.2(A) J1.08 J1.10 J1.12 J1.15 J1.25 J1.26 U3.2(COMMON_ANODE) U6.2(COMMON_ANODE) U7.2(COMMON_ANODE) U8.2(COMMON_ANODE)
DAT: J1.21 J1.22 U3.3(CATHODE(DIODE_2)) ; port DAT
IU+: R24.1 ; port IU+
IU-: R31.1 ; port IU-
IV+: R30.2 ; port IV+
IV-: R23.2 ; port IV-
IW+: R33.2 ; port IW+
IW-: R32.2 ; port IW-
~{PG}_S: J1.18 ; port ~{PG}
SCK: J1.19 J1.20 U3.1(CATHODE(DIODE_1)) ; port SCK  [project net HALL_SPI_CLK_S]
U+: C42.2 J1.05 R24.2 U6.6(CATHODE(DIODE_5))
U-: C42.1 J1.01 R31.2 U6.4(CATHODE(DIODE_3))
U_A_IN: J1.11 U6.1(CATHODE(DIODE_1)) ; port U_A_IN
U_B_IN: J1.09 U6.3(CATHODE(DIODE_2)) ; port U_B_IN
U_EN: J1.07 J1.34 J1.35 U3.6(CATHODE(DIODE_5)) ; port U_EN, port V_EN, port W_EN  [also labelled V_EN, W_EN]  [project net OE]
U_OC: J1.03 ; port U_OC
U_TEMP: J1.13 U6.5(CATHODE(DIODE_4)) ; port U_TEMP  [project net TEMP1]
V+: C41.1 J1.33 R30.1 U7.4(CATHODE(DIODE_3))
V-: C41.2 J1.29 R23.1 U7.6(CATHODE(DIODE_5))
V_A_IN: J1.39 U7.3(CATHODE(DIODE_2)) ; port V_A_IN
V_B_IN: J1.37 U7.1(CATHODE(DIODE_1)) ; port V_B_IN
V_N_S: C34.1 J1.04 R35.2 U3.4(CATHODE(DIODE_3))
V_OC: J1.31 ; port V_OC
V_P_S: C34.2 J1.02 R34.2 U3.5(CATHODE(DIODE_4))
V_SENSE_N: R35.1 ; port V_N
V_SENSE_P: R34.1 ; port V_P
V_TEMP: J1.27 U7.5(CATHODE(DIODE_4)) ; port V_TEMP  [project net TEMP2]
W+: C43.1 J1.36 R33.1 U8.1(CATHODE(DIODE_1))
W-: C43.2 J1.40 R32.1 U8.3(CATHODE(DIODE_2))
W_A_IN: J1.30 U8.6(CATHODE(DIODE_5)) ; port W_A_IN
W_B_IN: J1.32 U8.4(CATHODE(DIODE_3)) ; port W_B_IN
W_OC: J1.38 ; port W_OC
W_TEMP: J1.28 U8.5(CATHODE(DIODE_4)) ; port W_TEMP  [project net TEMP3]

### Notes on the sheet
- DWG. NO.
- REV.
- SHT.
- THIS DOCUMENT AND THE DATA DISCLOSED HEREIN OR HEREWITH IS THE PROPERTY OF ALTIUM LIMITED AND MAY BE FREELY DISTRIBUTED IN WHOLE. NO RIGHTS ARE RESERVED OR EXPRESS OR IMPLIED WARANTEE GIVEN.
- REVISION
- DESCRIPTION
- DATE
- APPROVED
- ENG:
- APPROVALS
- PROJECT
- DSN:
- CHK:
- REFERENCE DOCUMENTS
- PROJECT REVISION:
- TITLE
- DOCUMENT REVISION:
- DESIGN ITEM:
- BOM:
- FAB DWG:
- PCB DWG:
- ASSY DWG:
- SCALE:
- SIZE
- B
- CAGE CODE
- FILE NAME
- DWG NO.
- SHEET
- OF
- REV

### Library data of the parts
C34 = UMK105CG102JVHF: CAP CER 1000PF 50V C0G/NP0 0402; manufacturer: Taiyo Yuden; Temperature Coefficient: C0G, NP0; Tolerance: ±5%; Part Number: UMK105CG102JVHF; Capacitance: 1000 pF; Applications: Automotive; componentlink1description: Datasheet; componentlink1url: https://ds.yuden.co.jp/TYCOMPAS/ut/detail?pn=UMK105CG102JVHF &u=M; componentlink2description: DigiKey Link; componentlink2url: https://www.digikey.com/en/products/detail/taiyo-yuden/UMK105CG102JVHF/4811103; Device Package: 0402 (1005 Metric); lastupdated: 2/9/2024 8:04:38 PM; Lifecycle Status: Active; Minimum Order: 1; Mounting Type: Surface Mount, MLCC; Operating Temperature: -55°C ~ 125°C; Package / Case: 0402 (1005 Metric); packaging: TapeAndReel; partid: 1779; Part Status: Active; price: 0.01; Ratings: AEC-Q200; series: M; Size / Dimension: 0.039" L x 0.020" W (1.00mm x 0.50mm); Supplier 1: DigiKey; Supplier Part Number 1: 587-3737-1-ND; Thickness (Max): 0.022" (0.55mm); value: 1000 pF; Voltage - Rated: 50V
C41-C43 = CMP-001-00061-3: Chip Capacitor, 100nF +/-20%, 10V, 0402, Thickness 0.6 mm; Tolerance: 20%; Mounting Technology: SMT; Voltage Rating: 10V; Max Operating Temperature: 85°C; Pins: 2; Case/Package: 0402; Min Operating Temperature: -55°C
D5 = CMP-1061-00626-1: 200 W Transient Voltage Suppressor, 2-Pin SOD-123FL, Pb-Free, Tape and Reel; Manufacturer: On Semiconductor; Direction: Unidirectional; V(BR) Typ (V): 14; IR Max (uA): 2.5; PackageDescription: 2-Pin SOD, Body 1.65 x 2.7 mm; ComponentLink2URL: http://www.onsemi.com/pub_link/Collateral/SMF5.0AT1-D.PDF; DatasheetVersion: Rev. 7; PartNumber: SMF12AT1G; ComponentLink1Description: Manufacturer URL; ComponentLink2Description: Datasheet; ComponentLink1URL: http://www.onsemi.com/; ComponentLink3Description: Package Specification; Mounting Technology: Surface Mount; PackageReference: SOD-123FL-2-498; RoHS: Pb-Free; PackageVersion: Rev. D, 05/2013; Packing: Tape and Reel; ComponentLink3URL: http://www.onsemi.com/pub_link/Collateral/498-01.PDF
D6 = CMP-14432-000009-1: TVS DIODE 3.3VWM 11VC SOD523; RoHS Compliant: Yes
R23 = WR04X1500FTL: RES 150 OHM 1% 1/16W 0402; Manufacturer: Walsin Technology Corporation; Value: 50; Power (Watts): 0.063W, 1/16W; Resistance: 150 Ohms; Temperature Coefficient: ±100ppm/°C; Part Number: WR04X1500FTL; ComponentLink1Description: Datasheet; ComponentLink1URL: https://www.passivecomponent.com/wp-content/uploads/chipR/ASC_WR.pdf; ComponentLink2Description: DigiKey Link; ComponentLink2URL: https://www.digikey.com/en/products/detail/walsin-technology-corporation/WR04X1500FTL/13238657; Composition: Thick Film; Device Package: 0402 (1005 Metric); Height - Seated (Max): 0.016" (0.40mm); LastUpdated: 2/9/2024 8:28:55 PM; Lifecycle Status: Active; Minimum Order: 1; Number of Terminations: 2; Operating Temperature: -55°C ~ 155°C; Package / Case: 0402 (1005 Metric); Packaging: CutTape; PartId: 64765; Part Status: Active; Price: 0.01; Series: WR; Size / Dimension: 0.039" L x 0.020" W (1.00mm x 0.50mm); Supplier 1: DigiKey; Supplier Part Number 1: 1292-WR04X1500FTLCT-ND; Supplier Device Package: 0402; Tolerance: ±1%
R24 R30-R33 = WR04X1500FTL: RES 150 OHM 1% 1/16W 0402; Manufacturer: Walsin Technology Corporation; Power (Watts): 0.063W, 1/16W; Resistance: 150 Ohms; Temperature Coefficient: ±100ppm/°C; Part Number: WR04X1500FTL; Value: 50 Ohms; ComponentLink1Description: Datasheet; ComponentLink1URL: https://www.passivecomponent.com/wp-content/uploads/chipR/ASC_WR.pdf; ComponentLink2Description: DigiKey Link; ComponentLink2URL: https://www.digikey.com/en/products/detail/walsin-technology-corporation/WR04X1500FTL/13238657; Composition: Thick Film; Device Package: 0402 (1005 Metric); Height - Seated (Max): 0.016" (0.40mm); LastUpdated: 2/9/2024 8:28:55 PM; Lifecycle Status: Active; Minimum Order: 1; Number of Terminations: 2; Operating Temperature: -55°C ~ 155°C; Package / Case: 0402 (1005 Metric); Packaging: CutTape; PartId: 64765; Part Status: Active; Price: 0.01; Series: WR; Size / Dimension: 0.039" L x 0.020" W (1.00mm x 0.50mm); Supplier 1: DigiKey; Supplier Part Number 1: 1292-WR04X1500FTLCT-ND; Supplier Device Package: 0402; Tolerance: ±1%
R34 R35 = WR04X1500FTL: RES 150 OHM 1% 1/16W 0402; Manufacturer: Walsin Technology Corporation; Power (Watts): 0.063W, 1/16W; Temperature Coefficient: ±100ppm/°C; Part Number: WR04X1500FTL; Value: 150 Ohms; ComponentLink1Description: Datasheet; ComponentLink1URL: https://www.passivecomponent.com/wp-content/uploads/chipR/ASC_WR.pdf; ComponentLink2Description: DigiKey Link; ComponentLink2URL: https://www.digikey.com/en/products/detail/walsin-technology-corporation/WR04X1500FTL/13238657; Composition: Thick Film; Device Package: 0402 (1005 Metric); Height - Seated (Max): 0.016" (0.40mm); LastUpdated: 2/9/2024 8:28:55 PM; Lifecycle Status: Active; Minimum Order: 1; Number of Terminations: 2; Operating Temperature: -55°C ~ 155°C; Package / Case: 0402 (1005 Metric); Packaging: CutTape; PartId: 64765; Part Status: Active; Price: 0.01; Resistance: 150 Ohms; Series: WR; Size / Dimension: 0.039" L x 0.020" W (1.00mm x 0.50mm); Supplier 1: DigiKey; Supplier Part Number 1: 1292-WR04X1500FTLCT-ND; Supplier Device Package: 0402; Tolerance: ±1%
U3 U6-U8 = CMP-14432-000006-1: TVS DIODE 3.3VWM 12VC 6TSSOP; RoHS Compliant: Yes
J1 = LSHM-120-01-L-DH-A-S-K-TR: Value: *

## Sheet EnDat.SchDoc
size A; SheetNumber: 2; SheetTotal: 11
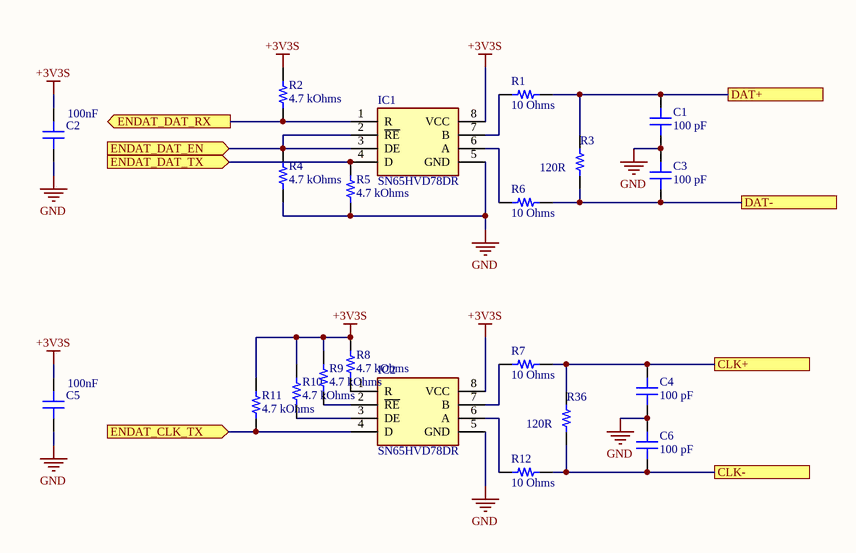
[diagram p3: EnDat.SchDoc]

### Parts
C1  100 pF  [CAP 0402_1005]
C2  100nF  [CAP 0402_1005]
C3  100 pF  [CAP 0402_1005]
C4  100 pF  [CAP 0402_1005]
C5  100nF  [CAP 0402_1005]
C6  100 pF  [CAP 0402_1005]
IC1  SN65HVD78DR  [SOIC127P600X175-8N]
IC2  SN65HVD78DR  [SOIC127P600X175-8N]
R1  10 Ohms  [RES 0402_1005]
R2  4.7 kOhms  [RES 0402_1005]
R3  120R  [RES 0603_1608]
R4  4.7 kOhms  [RES 0402_1005]
R5  4.7 kOhms  [RES 0402_1005]
R6  10 Ohms  [RES 0402_1005]
R7  10 Ohms  [RES 0402_1005]
R8  4.7 kOhms  [RES 0402_1005]
R9  4.7 kOhms  [RES 0402_1005]
R10  4.7 kOhms  [RES 0402_1005]
R11  4.7 kOhms  [RES 0402_1005]
R12  10 Ohms  [RES 0402_1005]
R36  120R  [RES 0603_1608]

### Ports
CLK+, CLK-, DAT+, DAT-, ENDAT_CLK_TX (in), ENDAT_DAT_EN (in), ENDAT_DAT_RX (out), ENDAT_DAT_TX (in)

### Nets
+3V3S: C2.2 C5.2 IC1.8(VCC) IC2.8(VCC) R2.2 R8.2 R9.2 R10.2 R11.2  [project net 3V]
GND: C1.1 C2.1 C3.2 C4.1 C5.1 C6.2 IC1.5(GND) IC2.5(GND) R4.1 R5.1
ENC_CLB_CLK: IC2.4(D) R11.1 ; port ENDAT_CLK_TX
ENC_DAT_EN: IC1.2(~{RE}) IC1.3(DE) R4.2 ; port ENDAT_DAT_EN
ENC_SPI_MISO: IC1.1(R) R2.1 ; port ENDAT_DAT_RX
ENC_SPI_MOSI: IC1.4(D) R5.2 ; port ENDAT_DAT_TX
NetC1_2: C1.2 R1.2 R3.2 ; port DAT+
NetC3_1: C3.1 R3.1 R6.2 ; port DAT-
NetC4_2: C4.2 R7.2 R36.2 ; port CLK+
NetC6_1: C6.1 R12.2 R36.1 ; port CLK-
NetIC1_6: IC1.6(A) R6.1
NetIC1_7: IC1.7(B) R1.1
NetIC2_1: IC2.1(R) R8.1
NetIC2_2: IC2.2(~{RE}) R9.1
NetIC2_3: IC2.3(DE) R10.1
NetIC2_6: IC2.6(A) R12.1
NetIC2_7: IC2.7(B) R7.1

### Library data of the parts
C1 C3 C4 C6 = 500X07N101MV4T: CAP CER 100PF 50V C0G/NP0 0402; manufacturer: Johanson Dielectrics Inc.; Temperature Coefficient: C0G, NP0; Tolerance: ±20%; Part Number: 500X07N101MV4T; Capacitance: 100 pF; Applications: Bypass, Decoupling; componentlink1description: Datasheet; componentlink1url: https://www.johansondielectrics.com/downloads/x2y-filter-and-decoupling-capacitors.pdf; componentlink2description: DigiKey Link; componentlink2url: https://www.digikey.com/en/products/detail/johanson-dielectrics-inc/500X07N101MV4T/2046917; Device Package: 0402 (1005 Metric); Features: Low ESL (X2Y); lastupdated: 2/9/2024 8:04:38 PM; Lifecycle Status: Active; Minimum Order: 1; Mounting Type: Surface Mount, MLCC; Operating Temperature: -55°C ~ 125°C; Package / Case: 0402 (1005 Metric); packaging: TapeAndReel; partid: 1767; Part Status: Active; price: 0.08; series: X2Y®; Size / Dimension: 0.045" L x 0.025" W (1.14mm x 0.64mm); Supplier 1: DigiKey; Supplier Part Number 1: 709-1214-1-ND; Thickness (Max): 0.020" (0.51mm); value: 100 pF; Voltage - Rated: 50V
C2 C5 = CL05A105KO5NNNC: CAP CER 1UF 16V X5R 0402; Part Number: C29266; manufacturer: Samsung Electro-Mechanics; Capacitance: 10uF; Tolerance: ±10%; value: 1 µF; Applications: General Purpose; componentlink1description: Datasheet; componentlink1url: http://www.samsungsem.com/kr/support/product-search/mlcc/CL05A105KO5NNNC.jsp; componentlink2description: DigiKey Link; componentlink2url: https://www.digikey.com/en/products/detail/samsung-electro-mechanics/CL05A105KO5NNNC/3886725; Device Package: 0402 (1005 Metric); lastupdated: 2/9/2024 8:04:35 PM; Lifecycle Status: Active; Minimum Order: 1; Mounting Type: Surface Mount, MLCC; Operating Temperature: -55°C ~ 85°C; Package / Case: 0402 (1005 Metric); packaging: TapeAndReel; partid: 3120; Part Status: Active; price: 0.01; series: CL; Size / Dimension: 0.039" L x 0.020" W (1.00mm x 0.50mm); Supplier 1: DigiKey; Supplier Part Number 1: 1276-1067-1-ND; Temperature Coefficient: X5R; Thickness (Max): 0.022" (0.55mm); Voltage - Rated: 16V
IC1 IC2 = SN65HVD78DR: Integrated Circuit; Manufacturer_Name: Texas Instruments; Datasheet Link: http://www.ti.com/lit/gpn/sn65hvd78; Height: 1.75mm; Manufacturer_Part_Number: SN65HVD78DR; Mouser Part Number: 595-SN65HVD78DR; Mouser Price/Stock: https://www.mouser.co.uk/ProductDetail/Texas-Instruments/SN65HVD78DR?qs=GIZt7gVh5wSQImLM3RD5ag%3D%3D; Arrow Part Number: SN65HVD78DR; Arrow Price/Stock: https://www.arrow.com/en/products/sn65hvd78dr/texas-instruments?region=nac
R1 R6 R7 R12 = WR04X100 JTL: RES 10 OHM 5% 1/16W 0402; Manufacturer: Walsin Technology Corporation; Power (Watts): 0.063W, 1/16W; Temperature Coefficient: -200/ +400ppm/°C; Part Number: WR04X100 JTL; Value: 10 Ohms; ComponentLink1Description: Datasheet; ComponentLink1URL: https://www.passivecomponent.com/wp-content/uploads/chipR/ASC_WR.pdf; ComponentLink2Description: DigiKey Link; ComponentLink2URL: https://www.digikey.com/en/products/detail/walsin-technology-corporation/WR04X100-JTL/13241174; Composition: Thick Film; Device Package: 0402 (1005 Metric); Height - Seated (Max): 0.016" (0.40mm); LastUpdated: 2/9/2024 8:28:55 PM; Lifecycle Status: Active; Minimum Order: 1; Number of Terminations: 2; Operating Temperature: -55°C ~ 155°C; Package / Case: 0402 (1005 Metric); Packaging: CutTape; PartId: 64776; Part Status: Active; Price: 0.01; Resistance: 10 Ohms; Series: WR; Size / Dimension: 0.039" L x 0.020" W (1.00mm x 0.50mm); Supplier 1: DigiKey; Supplier Part Number 1: 1292-WR04X100JTLCT-ND; Supplier Device Package: 0402; Tolerance: ±5%
R2 R4 R5 R8-R11 = WR04X4701FTL: RES 4.7K OHM 1% 1/16W 0402; Manufacturer: Walsin Technology Corporation; Power (Watts): 0.063W, 1/16W; Temperature Coefficient: ±100ppm/°C; Part Number: WR04X4701FTL; Value: 4.7 kOhms; ComponentLink1Description: Datasheet; ComponentLink1URL: https://www.passivecomponent.com/wp-content/uploads/chipR/ASC_WR.pdf; ComponentLink2Description: DigiKey Link; ComponentLink2URL: https://www.digikey.com/en/products/detail/walsin-technology-corporation/WR04X4701FTL/13239186; Composition: Thick Film; Device Package: 0402 (1005 Metric); Height - Seated (Max): 0.016" (0.40mm); LastUpdated: 2/9/2024 8:28:34 PM; Lifecycle Status: Active; Minimum Order: 1; Number of Terminations: 2; Operating Temperature: -55°C ~ 155°C; Package / Case: 0402 (1005 Metric); Packaging: CutTape; PartId: 77487; Part Status: Active; Price: 0.01; Resistance: 4.7 kOhms; Series: WR; Size / Dimension: 0.039" L x 0.020" W (1.00mm x 0.50mm); Supplier 1: DigiKey; Supplier Part Number 1: 1292-WR04X4701FTLCT-ND; Supplier Device Package: 0402; Tolerance: ±1%
R3 R36 = CR0603AFX-10R0EAS: RESA-AS 0603 10R 1% 100MW TC100; Manufacturer: Bourns Inc.; Value: 510R; Power (Watts): 0.1W, 1/10W; Resistance: 10 Ohms; Temperature Coefficient: ±100ppm/°C; Part Number: CR0603AFX-10R0EAS; ComponentLink1Description: Datasheet; ComponentLink1URL: //media.digikey.com/pdf/Data%20Sheets/Bourns%20PDFs/CRyyyyA-AS_Model_DS.pdf; ComponentLink2Description: DigiKey Link; ComponentLink2URL: https://www.digikey.com/en/products/detail/bourns-inc/CR0603AFX-10R0EAS/10240119; Composition: Thick Film; Device Package: 0603 (1608 Metric); Features: Anti-Sulfur, Automotive AEC-Q200, Moisture Resistant; Height - Seated (Max): 0.022" (0.55mm); LastUpdated: 2/9/2024 8:42:17 PM; Lifecycle Status: Active; Minimum Order: 1; Number of Terminations: 2; Operating Temperature: -55°C ~ 155°C; Package / Case: 0603 (1608 Metric); Packaging: TapeAndReel; PartId: 23787; Part Status: Active; Price: 0.01; Ratings: AEC-Q200; Series: CR0603A-AS; Size / Dimension: 0.063" L x 0.031" W (1.60mm x 0.80mm); Supplier 1: DigiKey; Supplier Part Number 1: CR0603AFX-10R0EASCT-ND; Supplier Device Package: 0603; Tolerance: ±1%
  R36: Type: *

## Sheet CANBus.SchDoc
size A; SheetNumber: 7; SheetTotal: 11
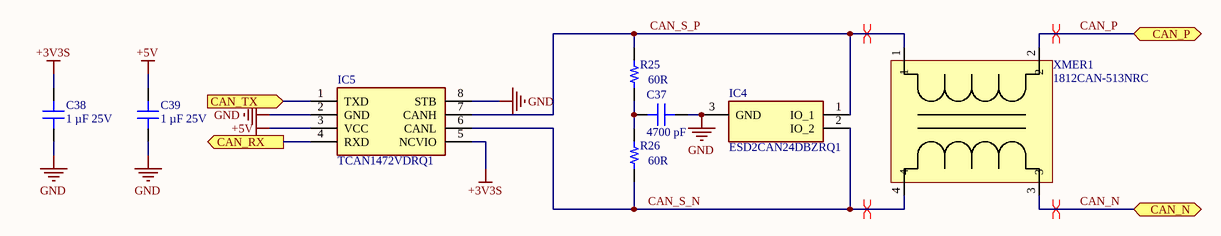
[diagram p4: CANBus.SchDoc]

### Parts
C37  4700 pF  [CAP 0603_1608]
C38  Capacitance: 1 µF 25V  [CAP 0402_1005]  (hidden comment: 1 µF)
C39  Capacitance: 1 µF 25V  [CAP 0402_1005]  (hidden comment: 1 µF)
IC4  ESD2CAN24DBZRQ1  [SOT95P237X112-3N]
IC5  TCAN1472VDRQ1  [SOIC127P600X175-8N]
R25  60R  [RES 0603_1608]
R26  60R  [RES 0603_1608]
XMER1  1812CAN-513NRC  [XMER_1812CAN-513NRC_COC]

### Ports
CAN_N (bidir), CAN_P (bidir), CAN_RX (out), CAN_TX (in)

### Nets
+3V3S: C38.2 IC5.5(NCVIO)  [project net 3V]
+5V: C39.2 IC5.3(VCC)
GND: C37.2 C38.1 C39.1 IC4.3(GND) IC5.2(GND) IC5.8(STB)
CAN_N: XMER1.3 ; port CAN_N
CAN_P: XMER1.2 ; port CAN_P
CAN_S_N: IC4.2(IO_2) IC5.6(CANL) R26.1 XMER1.4
CAN_S_P: IC4.1(IO_1) IC5.7(CANH) R25.2 XMER1.1
FDCAN1_RX: IC5.4(RXD) ; port CAN_RX
FDCAN1_TX: IC5.1(TXD) ; port CAN_TX
NetC37_1: C37.1 R25.1 R26.2

### Layout directives
differential pair: CAN_N, CAN_P, CAN_S_N, CAN_S_P

### Library data of the parts
C37 = C0603C472K4RECAUTO: CAP CER 0603 4.7NF 16V X7R 10%; manufacturer: KEMET; Part Number: C0603C472K4RECAUTO; value: 4700 pF; Applications: Automotive, ESD Protection; Capacitance: 4700 pF; componentlink1description: Datasheet; componentlink1url: https://api.kemet.com/component-edge/download/datasheet/C0603C472K4RECAUTO.pdf; componentlink2description: DigiKey Link; componentlink2url: https://www.digikey.com/en/products/detail/kemet/C0603C472K4RECAUTO/8640473; Device Package: 0603 (1608 Metric); lastupdated: 2/9/2024 8:10:07 PM; Lifecycle Status: Active; Minimum Order: 1; Mounting Type: Surface Mount, MLCC; Operating Temperature: -55°C ~ 125°C; Package / Case: 0603 (1608 Metric); packaging: TapeAndReel; partid: 17340; Part Status: Active; price: 0.01; Ratings: AEC-Q200; series: ESD SMD Auto X7R; Size / Dimension: 0.063" L x 0.031" W (1.60mm x 0.80mm); Supplier 1: DigiKey; Supplier Part Number 1: 399-17879-1-ND; Temperature Coefficient: X7R; Thickness (Max): 0.034" (0.87mm); Tolerance: ±10%; Voltage - Rated: 16V
C38 C39 = LMK105BJ105KPLF: CAP CER 1UF 10V X5R 0402; manufacturer: Taiyo Yuden; Tolerance: ±10%; Part Number: LMK105BJ105KPLF; Applications: SMPS Filtering; componentlink1description: Datasheet; componentlink1url: https://ds.yuden.co.jp/TYCOMPAS/ut/detail?pn=LMK105BJ105KPLF &u=M; componentlink2description: DigiKey Link; componentlink2url: https://www.digikey.com/en/products/detail/taiyo-yuden/LMK105BJ105KPLF/7403744; Device Package: 0402 (1005 Metric); lastupdated: 2/9/2024 8:04:36 PM; Lifecycle Status: Active; Minimum Order: 1; Mounting Type: Surface Mount, MLCC; Operating Temperature: -55°C ~ 85°C; Package / Case: 0402 (1005 Metric); packaging: TapeAndReel; partid: 2328; Part Status: Active; price: 0.02; series: M; Size / Dimension: 0.039" L x 0.020" W (1.00mm x 0.50mm); Supplier 1: DigiKey; Supplier Part Number 1: 587-6274-1-ND; Temperature Coefficient: X5R; Thickness (Max): 0.026" (0.65mm); value: 1 µF; Voltage - Rated: 10V
IC4 = ESD2CAN24DBZRQ1: Integrated Circuit; Manufacturer_Name: Texas Instruments; Datasheet Link: https://www.ti.com/lit/ds/symlink/esd2can24-q1.pdf?ts=1669637432096&ref_url=https%253A%252F%252Fwww.ti.com%252Fproduct%252FESD2CAN24-Q1; Height: 1.12mm; Manufacturer_Part_Number: ESD2CAN24DBZRQ1; Mouser Part Number: 595-ESD2CAN24DBZRQ1; Mouser Price/Stock: https://www.mouser.co.uk/ProductDetail/Texas-Instruments/ESD2CAN24DBZRQ1?qs=Y0Uzf4wQF3knJz9mU6BNuw%3D%3D; Arrow Part Number: ESD2CAN24DBZRQ1; Arrow Price/Stock: https://www.arrow.com/en/products/esd2can24dbzrq1/texas-instruments?utm_currency=USD&region=nac
IC5 = TCAN1472VDRQ1: Integrated Circuit; Manufacturer_Name: Texas Instruments; Datasheet Link: https://www.ti.com/lit/ds/symlink/tcan1472-q1.pdf; Height: 1.75mm; Manufacturer_Part_Number: TCAN1472VDRQ1; Mouser Part Number: 595-TCAN1472VDRQ1; Mouser Price/Stock: https://www.mouser.co.uk/ProductDetail/Texas-Instruments/TCAN1472VDRQ1?qs=7%2F6SraaimPTs1XgFSA%2FENg%3D%3D
R25 R26 = RMCF0603JT560R: RES 560 OHM 5% 1/10W 0603; Manufacturer: Stackpole Electronics Inc; Value: 560 Ohms; Power (Watts): 0.1W, 1/10W; Temperature Coefficient: ±200ppm/°C; Part Number: RMCF0603JT560R; ComponentLink1Description: Datasheet; ComponentLink1URL: https://www.seielect.com/catalog/sei-rmcf_rmcp.pdf; ComponentLink2Description: DigiKey Link; ComponentLink2URL: https://www.digikey.com/en/products/detail/stackpole-electronics-inc/RMCF0603JT560R/1712305; Composition: Thick Film; Device Package: 0603 (1608 Metric); Features: Automotive AEC-Q200; Height - Seated (Max): 0.022" (0.55mm); LastUpdated: 2/9/2024 8:43:32 PM; Lifecycle Status: Active; Minimum Order: 1; Number of Terminations: 2; Operating Temperature: -55°C ~ 155°C; Package / Case: 0603 (1608 Metric); Packaging: CutTape; PartId: 5967; Part Status: Active; Price: 0.01; Ratings: AEC-Q200; Resistance: 560 Ohms; Series: RMCF; Size / Dimension: 0.061" L x 0.031" W (1.55mm x 0.80mm); Supplier 1: DigiKey; Supplier Part Number 1: RMCF0603JT560RCT-ND; Supplier Device Package: 0603; Tolerance: ±5%
XMER1 = 1812CAN-513NRC: No Description Available; Mfr_Name: Coilcraft; RefDes: RefDes; Type: Type

## Sheet PeripheralConnector.SchDoc
size A; SheetNumber: 7; SheetTotal: 11
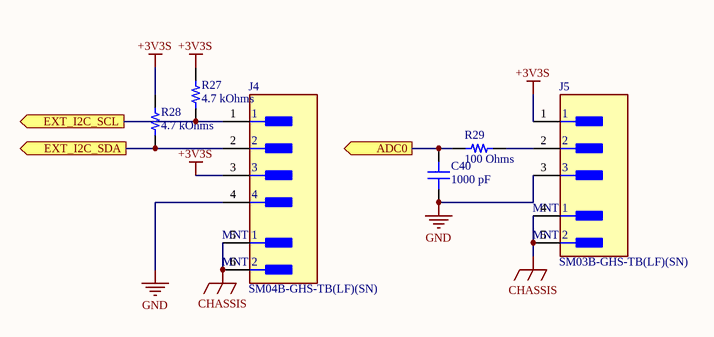
[diagram p5: PeripheralConnector.SchDoc]

### Parts
C40  1000 pF  [CAP 0402_1005]
J4  SM04B-GHS-TB(LF)(SN)  [FP-SM04B-GHS-TB_LF_SN-MFG]
J5  SM03B-GHS-TB(LF)(SN)  [FP-SM03B-GHS-TB_LF_SN-MFG]
R27  4.7 kOhms  [RES 0402_1005]
R28  4.7 kOhms  [RES 0402_1005]
R29  100 Ohms  [RES 0402_1005]

### Ports
ADC0 (out), EXT_I2C_SCL (out), EXT_I2C_SDA (out)

### Nets
+3V3S: J4.3 J5.1 R27.2 R28.2  [project net 3V]
CHASSIS: J4.5(MNT_1) J4.6(MNT_2) J5.4(MNT_1) J5.5(MNT_2)
GND: C40.1 J4.4 J5.3
ADC0: C40.2 R29.1 ; port ADC0
I2C1_SCK: J4.1 R27.1 ; port EXT_I2C_SCL
I2C1_SDA: J4.2 R28.1 ; port EXT_I2C_SDA
NetJ5_2: J5.2 R29.2

### Library data of the parts
C40 = UMK105CG102JVHF: as C34 on sheet Connector; Part Number: UMK105CG102JVHF; Capacitance: 1000 pF; Applications: Automotive; componentlink1description: Datasheet; componentlink1url: https://ds.yuden.co.jp/TYCOMPAS/ut/detail?pn=UMK105CG102JVHF &u=M; componentlink2description: DigiKey Link; componentlink2url: https://www.digikey.com/en/products/detail/taiyo-yuden/UMK105CG102JVHF/4811103; Device Package: 0402 (1005 Metric); lastupdated: 2/9/2024 8:04:38 PM; Lifecycle Status: Active; Minimum Order: 1; Mounting Type: Surface Mount, MLCC; Operating Temperature: -55°C ~ 125°C; Package / Case: 0402 (1005 Metric); packaging: TapeAndReel; partid: 1779; Part Status: Active; price: 0.01; Ratings: AEC-Q200; series: M; Size / Dimension: 0.039" L x 0.020" W (1.00mm x 0.50mm); Supplier 1: DigiKey; Supplier Part Number 1: 587-3737-1-ND; Thickness (Max): 0.022" (0.55mm); value: 1000 pF; Voltage - Rated: 50V
J4 = CMP-17439-000411-1: CONN HEADER SMD R/A 4POS 1.25MM; Voltage Rating: 50V; Number of Contacts: 4; Current Rating: 1A; Termination: Solder; Mount: Surface Mount; REACH SVHC: No SVHC; Packaging: Cut Tape; Contact Material: Bronze; Series: GH; Orientation: Right Angle; Lead Free: Lead Free; Housing Material: Nylon; Contact Plating: Tin; Housing Color: Natural; Number of Rows: 1; Pitch: 1.25mm; Number of Positions: 4
J5 = CMP-17439-000068-1: CONN HEADER SMD R/A 3POS 1.25MM; Voltage Rating: 50V; Wire/Cable Gauge: 26AWG; Pitch: 0.049inch; Gender: Male; Number of Positions: 3; Current Rating: 1A; Orientation: Right Angle; REACH SVHC: No SVHC; Insulation Color: Natural; Housing Material: Nylon; Mount: Surface Mount; Flammability Rating: UL94 V-0; Color: Natural; Number of Rows: 1; Housing Color: Natural; Termination: Solder; Voltage Rating (AC): 50V; Max Operating Temperature: 85°C; Connector Type: Header; Series: GH; Packaging: Tape and Reel; Contact Finish - Mating: TIN; Lead Free: Lead Free; Fastening Type: Ramp; Contact Plating: Tin; Contact Material: Bronze; Insulation Material: Nylon; Contact Type: Outer Shroud Contact; Number of Contacts: 3; Min Operating Temperature: -25°C; Contact Shape: Rectangular
R27 R28 = WR04X4701FTL: as R2 on sheet EnDat; Part Number: WR04X4701FTL; Value: 4.7 kOhms; ComponentLink1Description: Datasheet; ComponentLink1URL: https://www.passivecomponent.com/wp-content/uploads/chipR/ASC_WR.pdf; ComponentLink2Description: DigiKey Link; ComponentLink2URL: https://www.digikey.com/en/products/detail/walsin-technology-corporation/WR04X4701FTL/13239186; Composition: Thick Film; Device Package: 0402 (1005 Metric); Height - Seated (Max): 0.016" (0.40mm); LastUpdated: 2/9/2024 8:28:34 PM; Lifecycle Status: Active; Minimum Order: 1; Number of Terminations: 2; Operating Temperature: -55°C ~ 155°C; Package / Case: 0402 (1005 Metric); Packaging: CutTape; PartId: 77487; Part Status: Active; Price: 0.01; Resistance: 4.7 kOhms; Series: WR; Size / Dimension: 0.039" L x 0.020" W (1.00mm x 0.50mm); Supplier 1: DigiKey; Supplier Part Number 1: 1292-WR04X4701FTLCT-ND; Supplier Device Package: 0402; Tolerance: ±1%
R29 = WR04X1000FTL: RES 100 OHM 1% 1/16W 0402; Manufacturer: Walsin Technology Corporation; Power (Watts): 0.063W, 1/16W; Temperature Coefficient: ±100ppm/°C; Part Number: WR04X1000FTL; Value: 100 Ohms; ComponentLink1Description: Datasheet; ComponentLink1URL: https://www.passivecomponent.com/wp-content/uploads/chipR/ASC_WR.pdf; ComponentLink2Description: DigiKey Link; ComponentLink2URL: https://www.digikey.com/en/products/detail/walsin-technology-corporation/WR04X1000FTL/13241075; Composition: Thick Film; Device Package: 0402 (1005 Metric); Height - Seated (Max): 0.016" (0.40mm); LastUpdated: 2/9/2024 8:28:55 PM; Lifecycle Status: Active; Minimum Order: 1; Number of Terminations: 2; Operating Temperature: -55°C ~ 155°C; Package / Case: 0402 (1005 Metric); Packaging: CutTape; PartId: 64787; Part Status: Active; Price: 0.01; Resistance: 100 Ohms; Series: WR; Size / Dimension: 0.039" L x 0.020" W (1.00mm x 0.50mm); Supplier 1: DigiKey; Supplier Part Number 1: 1292-WR04X1000FTLCT-ND; Supplier Device Package: 0402; Tolerance: ±1%